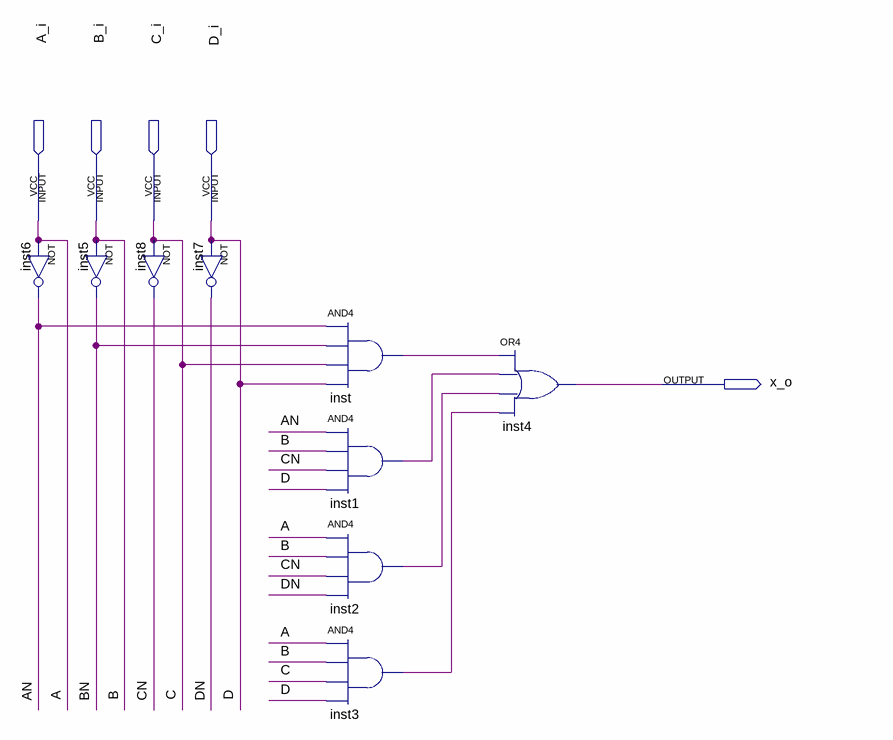
[diagram p0: schematic sheet]
// Quartus schematic circuito.bdf as structural Verilog: 9 symbols, 5 pins
module circuito (
  input  A_i,
  input  B_i,
  input  C_i,
  input  D_i,
  output x_o
);

  wire AN, BN, CN, DN, inst1_out, inst2_out, inst3_out, inst_out;

  not inst6 (AN, A_i);
  not inst5 (BN, B_i);
  not inst7 (DN, D_i);
  not inst8 (CN, C_i);
  and inst (inst_out, AN, BN, C_i, D_i);
  and inst1 (inst1_out, AN, B_i, CN, D_i);
  and inst2 (inst2_out, A_i, B_i, CN, DN);
  and inst3 (inst3_out, A_i, B_i, C_i, D_i);
  or inst4 (x_o, inst_out, inst1_out, inst2_out, inst3_out);

  // Other names for the same wires on the sheet: A = A_i; B = B_i; C = C_i; D = D_i
endmodule
